# EAGLE design digital_interface(1_1) (EAGLE 9.2.1)
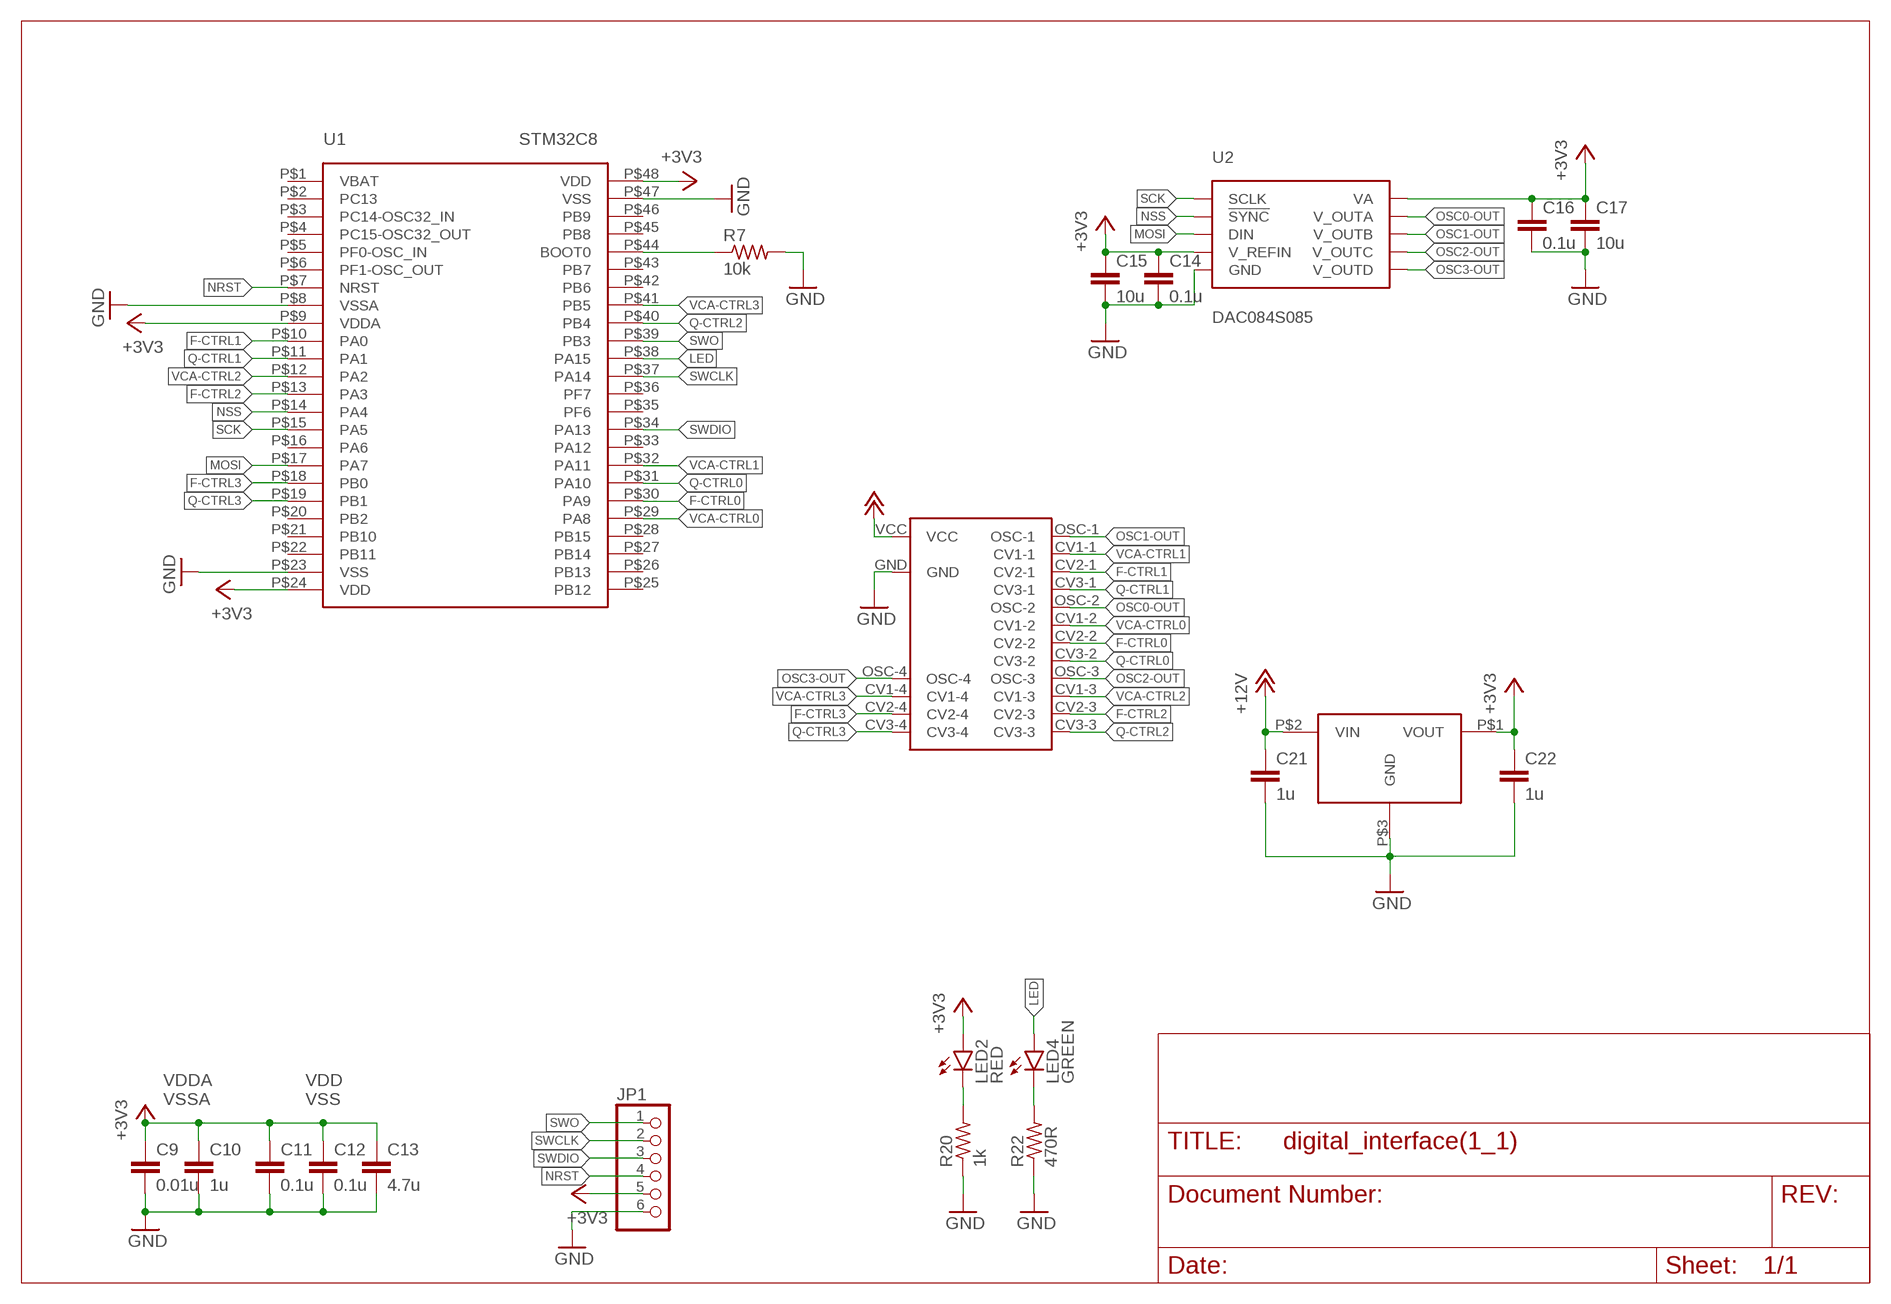
[diagram p0: schematic, sheet 1]

## Parts
C9  0.01u  C-EUC0603  [C0603]
C10  1u  C-EUC0603  [C0603]
C11  0.1u  C-EUC0603  [C0603]
C12  0.1u  C-EUC0603  [C0603]
C13  4.7u  C-EUC0603  [C0603]
C14  0.1u  C-EUC0603  [C0603]
C15  10u  C-EUC0603  [C0603]
C16  0.1u  C-EUC0603  [C0603]
C17  10u  C-EUC0603  [C0603]
C21  1u  C-EUC0603  [C0603]
C22  1u  C-EUC0603  [C0603]
JP1  PINHD-1X6  [1X06]
LED2  RED  LEDSMT1206  [1206]
LED4  GREEN  LEDSMT1206  [1206]
R7  10k  R-US_R0603  [R0603]
R20  1k  R-US_R0603  [R0603]
R22  470R  R-US_R0603  [R0603]
U1  STM32C8  [LQFP48]
U2  DAC084S085  [VSSOP10]
U3  TLV760  [SOT23-3]
U$1  CV_MODULE  [CV_MODULE]

## Nets
+3V3: C9.1 C10.1 C11.1 C12.1 C13.1 C14.1 C15.1 C16.1 C17.1 C22.1 JP1.5 LED2.A U1.P$9(VDDA) U1.P$24(VDD) U1.P$48(VDD) U2.P$1(VA) U2.P$7(V_REFIN) U3.P$1(VOUT)
+12V: C21.1 U3.P$2(VIN) U$1.VCC
F-CTRL0: U1.P$30(PA9) U$1.CV2-2
F-CTRL1: U1.P$10(PA0) U$1.CV2-1
F-CTRL2: U1.P$13(PA3) U$1.CV2-3
F-CTRL3: U1.P$18(PB0) U$1.CV2-4
GND: C9.2 C10.2 C11.2 C12.2 C13.2 C14.2 C15.2 C16.2 C17.2 C21.2 C22.2 JP1.6 R7.2 R20.1 R22.1 U1.P$8(VSSA) U1.P$23(VSS) U1.P$47(VSS) U2.P$6(GND) U3.P$3(GND) U$1.GND
LED: LED4.A U1.P$38(PA15)
MOSI: U1.P$17(PA7) U2.P$8(DIN)
N$8: R7.1 U1.P$44(BOOT0)
N$18: LED2.C R20.2
N$22: LED4.C R22.2
NRST: JP1.4 U1.P$7(NRST)
NSS: U1.P$14(PA4) U2.P$9(!SYNC)
OSC0-OUT: U2.P$2(V_OUTA) U$1.OSC-2
OSC1-OUT: U2.P$3(V_OUTB) U$1.OSC-1
OSC2-OUT: U2.P$4(V_OUTC) U$1.OSC-3
OSC3-OUT: U2.P$5(V_OUTD) U$1.OSC-4
Q-CTRL0: U1.P$31(PA10) U$1.CV3-2
Q-CTRL1: U1.P$11(PA1) U$1.CV3-1
Q-CTRL2: U1.P$40(PB4) U$1.CV3-3
Q-CTRL3: U1.P$19(PB1) U$1.CV3-4
SCK: U1.P$15(PA5) U2.P$10(SCLK)
SWCLK: JP1.2 U1.P$37(PA14)
SWDIO: JP1.3 U1.P$34(PA13)
SWO: JP1.1 U1.P$39(PB3)
VCA-CTRL0: U1.P$29(PA8) U$1.CV1-2
VCA-CTRL1: U1.P$32(PA11) U$1.CV1-1
VCA-CTRL2: U1.P$12(PA2) U$1.CV1-3
VCA-CTRL3: U1.P$41(PB5) U$1.CV1-4
Unconnected: U1.P$1(VBAT) U1.P$2(PC13) U1.P$3(PC14-OSC32_IN) U1.P$4(PC15-OSC32_OUT) U1.P$5(PF0-OSC_IN) U1.P$6(PF1-OSC_OUT) U1.P$16(PA6) U1.P$20(PB2) U1.P$21(PB10) U1.P$22(PB11) U1.P$25(PB12) U1.P$26(PB13) U1.P$27(PB14) U1.P$28(PB15) U1.P$33(PA12) U1.P$35(PF6) U1.P$36(PF7) U1.P$42(PB6) U1.P$43(PB7) U1.P$45(PB8) U1.P$46(PB9)

## Notes on the sheet
- VDDA
  VSSA
- VDD
  VSS

## Library data of the parts
C9-C17 C21 C22 = rcl:C-EU: CAPACITOR, European symbol; SPICEPREFIX: C
JP1 = pinhead:PINHD-1X6: PIN HEADER
LED2 LED4 = led:LED: LED OSRAM: - CHIPLED LG R971, LG N971, LY N971, LG Q971, LY Q971, LO R971, LY R971 LH N974, LH R974 LS Q976, LO Q976, LY Q976 LO Q996 - Hyper CHIPLED LW Q18S LB Q993, LB Q99A, LB R99A - SideLED LS A670, LO A670, LY A670, LG A670, LP A670 LB A673, LV A673, LT A673, LW A673 LH A674 LY A675 LS A676, LA A676, LO A676, LY A676, LW A676 LS A679, LY A679, LG A679 - Hyper Micro SIDELED® LS Y876, LA Y876, LO Y876, LY Y876 LT Y87S - SmartLED LW L88C, LW L88S LB L89C, LB L89S, LG L890 LS L89K, LO L89K, LY L89K LS L896, LA L896, LO L896, LY L896 - TOPLED LS T670, LO T670, LY T670, LG T670, LP T670 LSG T670, LSP T670, LSY T670, LOP T670, LYG T670 LG T671, LOG T671, LSG T671 LB T673, LV T673, LT T673, LW T673 LH T674 LS T676, LA T676, LO T676, LY T676, LB T676, LH T676, LSB T676, LW T676 LB T67C, LV T67C, LT T67C, LS T67K, LO T67K, LY T67K, LW E67C LS E67B, LA E67B, LO E67B, LY E67B, LB E67C, LV E67C, LT E67C LW T67C LS T679, LY T679, LG T679 LS T770, LO T770, LY T770, LG T770, LP T770 LB T773, LV T773, LT T773, LW T773 LH T774 LS E675, LA E675, LY E675, LS T675 LS T776, LA T776, LO T776, LY T776, LB T776 LHGB T686 LT T68C, LB T68C - Hyper Mini TOPLED® LB M676 - Mini TOPLED Santana® LG M470 LS M47K, LO M47K, LY M47K Source: http://www.osram.convergy.de LUXEON: - LUMILED® LXK2-PW12-R00, LXK2-PW12-S00, LXK2-PW14-U00, LXK2-PW14-V00 LXK2-PM12-R00, LXK2-PM12-S00, LXK2-PM14-U00 LXK2-PE12-Q00, LXK2-PE12-R00, LXK2-PE12-S00, LXK2-PE14-T00, LXK2-PE14-U00 LXK2-PB12-K00, LXK2-PB12-L00, LXK2-PB12-M00, LXK2-PB14-N00, LXK2-PB14-P00, LXK2-PB14-Q00 LXK2-PR12-L00, LXK2-PR12-M00, LXK2-PR14-Q00, LXK2-PR14-R00 LXK2-PD12-Q00, LXK2-PD12-R00, LXK2-PD12-S00 LXK2-PH12-R00, LXK2-PH12-S00 LXK2-PL12-P00, LXK2-PL12-Q00, LXK2-PL12-R00 Source: www.luxeon.com KINGBRIGHT: KA-3528ASYC Source: www.kingbright.com
R7 R20 R22 = rcl:R-US_: RESISTOR, American symbol; SPICEPREFIX: R
U1 = synth:STM32C8
U2 = synth:DAC084S085
U3 = synth:TLV760
U$1 = synth:CV_MODULE

## Board
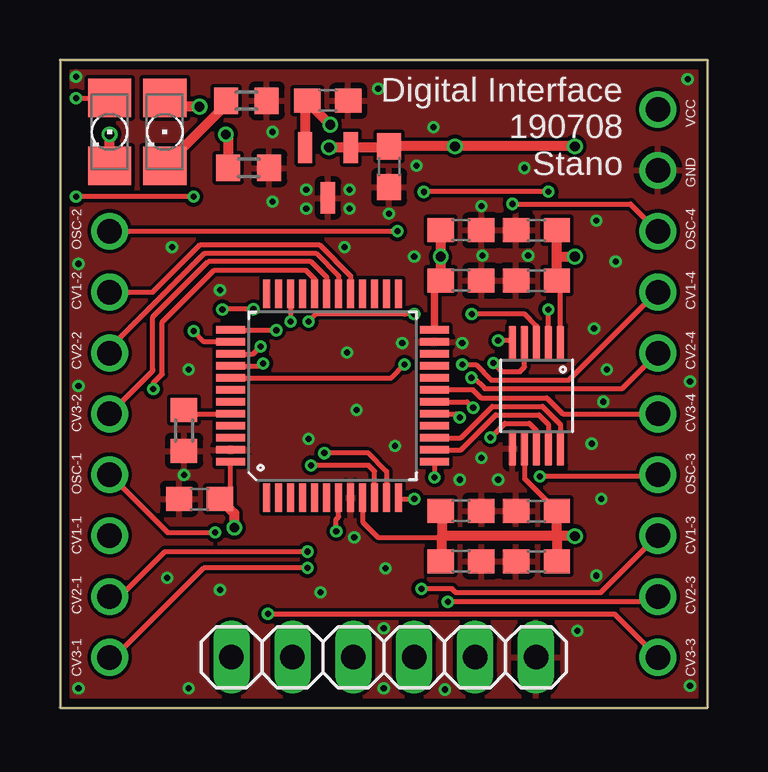
[diagram p1: board, top side]
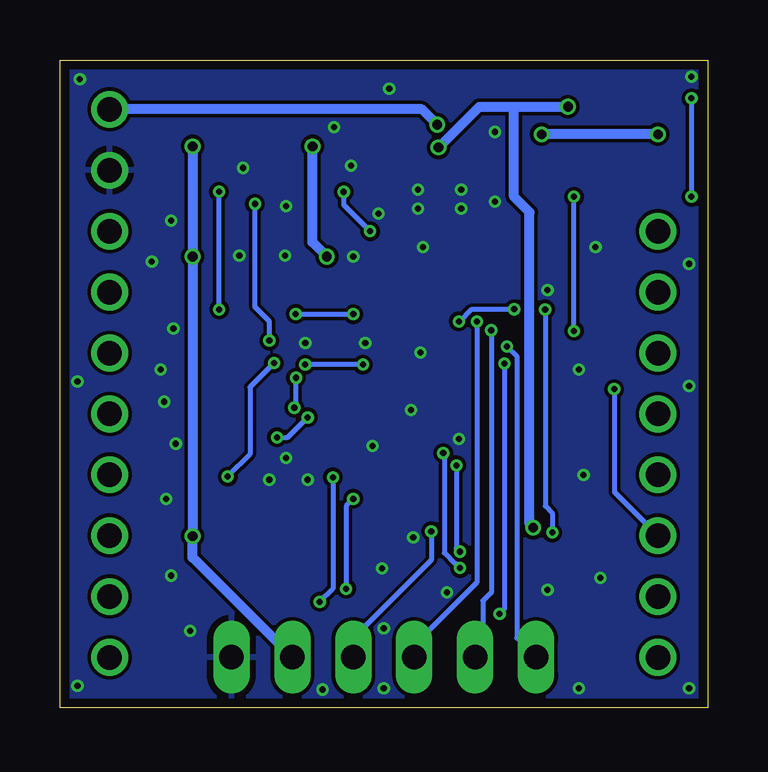
[diagram p2: board, bottom side, seen from below]

Size 27 x 27 mm. Coordinates in mm from the lower left corner, seen from the top.
Outline: 27,27 0,27 0,0 27,0 27,27
Copper layers (1*16): Top 0.035559375mm / dielectric 1.6mm / Bottom 0.035559375mm
Design rules "oshpark-2layer *": minimum track width 6mil, minimum drill 10mil, track to track 6mil, track to pad 6mil, pad to pad 6mil, via to via 6mil, smd to smd 6mil, copper to edge 15mil, drill to drill 6mil, minimum pad ring 5mil, minimum via ring 5mil, stop-mask expansion 2.5mil, vias tented up to drill 0.4mm, thermal gap 10mil

### Footprints (pad centres in the part's own frame; a part is rotated, then mirrored left to right if it is on the bottom)
C0603 = smd 1.1 x 1: 1 -0.85,0; 2 0.85,0
1X06 = drill 1.016 long: 1 -6.35,0; 2 -3.81,0; 3 -1.27,0; 4 1.27,0; 5 3.81,0; 6 6.35,0
1206 = smd 1.6 x 1.803: A -1.422,0; C 1.422,0
R0603 = smd 1 x 1.1: 1 -0.85,0; 2 0.85,0
LQFP48 = smd 0.3 x 1.2: P$1 -2.75,-4.25; P$2 -2.25,-4.25; P$3 -1.75,-4.25; P$4 -1.25,-4.25; P$5 -0.75,-4.25; P$6 -0.25,-4.25; P$7 0.25,-4.25; P$8 0.75,-4.25; P$9 1.25,-4.25; P$10 1.75,-4.25; P$11 2.25,-4.25; P$12 2.75,-4.25; P$25 2.75,4.25; P$26 2.25,4.25; P$27 1.75,4.25; P$28 1.25,4.25; P$29 0.75,4.25; P$30 0.25,4.25; P$31 -0.25,4.25; P$32 -0.75,4.25; P$33 -1.25,4.25; P$34 -1.75,4.25; P$35 -2.25,4.25; P$36 -2.75,4.25 | smd 1.2 x 0.3: P$13 4.25,-2.75; P$14 4.25,-2.25; P$15 4.25,-1.75; P$16 4.25,-1.25; P$17 4.25,-0.75; P$18 4.25,-0.25; P$19 4.25,0.25; P$20 4.25,0.75; P$21 4.25,1.25; P$22 4.25,1.75; P$23 4.25,2.25; P$24 4.25,2.75; P$37 -4.25,2.75; P$38 -4.25,2.25; P$39 -4.25,1.75; P$40 -4.25,1.25; P$41 -4.25,0.75; P$42 -4.25,0.25; P$43 -4.25,-0.25; P$44 -4.25,-0.75; P$45 -4.25,-1.25; P$46 -4.25,-1.75; P$47 -4.25,-2.25; P$48 -4.25,-2.75
VSSOP10 = smd 1.45 x 0.3: P$1 -2.2,1; P$2 -2.2,0.5; P$3 -2.2,0; P$4 -2.2,-0.5; P$5 -2.2,-1; P$6 2.2,-1; P$7 2.2,-0.5; P$8 2.2,0; P$9 2.2,0.5; P$10 2.2,1
SOT23-3 = smd 0.6 x 1.3: P$1 -0.95,-1.05; P$2 0.95,-1.05; P$3 0,1.05
CV_MODULE = drill 1.02: CV1-1 2.07,7.17; CV1-2 2.07,17.32; CV1-3 24.93,7.17; CV1-4 24.93,17.32; CV2-1 2.07,4.63; CV2-2 2.07,14.78; CV2-3 24.93,4.63; CV2-4 24.93,14.78; CV3-1 2.07,2.09; CV3-2 2.07,12.24; CV3-3 24.93,2.09; CV3-4 24.93,12.24; GND 24.93,22.4; OSC-1 2.07,9.71; OSC-2 2.07,19.86; OSC-3 24.93,9.71; OSC-4 24.93,19.86; VCC 24.93,24.94

### Placement (x,y rotation side)
C9  16.72,8.2 0 top
C10  16.72,6.1 0 top
C11  16.72,17.8 0 top
C12  5.82,8.7 180 top
C13  16.72,19.9 0 top
C14  19.87,8.2 180 top
C15  19.87,6.1 180 top
C16  19.87,17.8 180 top
C17  19.87,19.9 180 top
C21  11.17,25.3 0 top
C22  13.72,22.55 270 top
JP1  13.5,2.1 0 top
LED2  4.37,24 270 top
LED4  2.07,24 270 top
R7  5.17,11.55 270 top
R20  7.77,25.3 180 top
R22  7.87,22.5 180 top
U1  11.37,13 0 top
U2  19.87,13 270 top
U3  11.17,22.3 180 top
U$1  0,0 0 top

### Tracks (layer width: path | path; a pad name or v marks a point on that pad's centre or on a via)
+3V3  (via drill 0.4)
  Top 0.203: C11.1 15.62,17.55 | 4.74,25.05 LED2.A | U2.P$1 20.87,17.65 C16.1 | C12.1 7.12,9.15 U1.P$48 | C14.1 19.37,9.55 U2.P$7 | U1.P$9 12.62,7.75 13.27,7.1 15.87,7.1 15.92,7.15
  Top 0.305: 15.62,17.55 U1.P$24
  Top 0.406: v11.22,23.35 U3.P$1 13.67,23.35 C22.1 v16.47,23.4 v21.47,23.4 | v5.82,25.05 4.74,25.05 | C16.1 20.72,18.8 | 20.72,18.8 C17.1 | C13.1 v15.87,18.8 C11.1 | v21.47,7.15 20.72,7.15 | 20.72,7.15 C14.1 | 20.72,7.15 C15.1 | 20.72,18.8 v21.47,18.8 | 20.72,7.15 15.92,7.15 | C12.1 7.27,8.1 v7.27,7.5 | C9.1 15.92,8.15 15.92,7.15 | C10.1 15.92,6.15 15.92,7.15
  Bottom 0.406: v11.22,23.35 9.52,25.05 8.07,25.05 | 8.07,25.05 v5.82,25.05 | v21.47,23.4 v21.47,18.8 v21.47,7.15 21.47,6.26 JP1.5 | v7.27,7.5 7.42,7.65 7.42,20.65 8.07,21.3 8.07,25.05 | v15.87,18.8 16.47,19.4 v16.47,23.4
+12V  (via drill 0.4)
  Top 0.406: U3.P$2 10.22,25.2 C21.1 10.32,25.25 v11.27,24.3
  Bottom 0.406: v11.27,24.3 11.91,24.94 U$1.VCC
F-CTRL0
  Top 0.203: U1.P$30 11.62,17.99 10.67,18.94 6.03,18.94 2.07,14.98 U$1.CV2-2
F-CTRL1  (via drill 0.25)
  Top 0.203: U1.P$10 13.12,9.85 12.87,10.1 v10.47,10.1 | v10.32,6.5 4.37,6.5 2.5,4.63 U$1.CV2-1
  Bottom 0.203: v10.47,10.1 10.47,6.65 v10.32,6.5
F-CTRL2  (via drill 0.25)
  Top 0.203: U1.P$13 v15.62,9.6 | v16.17,4.41 24.71,4.41 U$1.CV2-3
  Bottom 0.203: v15.62,9.6 15.62,4.96 v16.17,4.41
F-CTRL3  (via drill 0.25)
  Top 0.203: U1.P$18 16.98,12.75 v17.23,12.5 | v17.16,13.75 17.26,13.75 17.71,13.3 20.41,13.3 20.42,13.3 23.45,13.3 U$1.CV2-4
  Bottom 0.203: v17.23,12.5 17.16,12.57 v17.16,13.75
GND  (via drill 0.25)
  other vias: 0.67,26.3 8.87,24 13.27,25.8 15.57,24.2 26.17,26.2 8.87,21.1 10.27,21.6 10.27,20.8 12.07,21.6 12.07,20.8 13.72,20.6 17.57,20.9 17.62,18.85 19.52,18.85 0.77,13.4 5.37,14.1 11.97,14.8 14.27,15.2 16.77,15.2 26.27,13.6 17.57,10.4 16.67,9.5 5.17,9.7 6.67,4.9 4.47,5.4 0.77,0.8 10.87,4.8 13.57,5.8 22.37,5.5 26.27,0.9 10.37,11.2 12.37,12.4 13.97,10.9 18.27,9.5 12.27,7.1 5.37,0.8 21.57,3.2 22.57,8.7 22.17,11 22.27,15.8 23.17,18.6 0.77,18.5 4.67,19.2 6.67,17.4 11.87,19.2 14.77,18.8 22.37,20.3 19.37,22.5 14.87,22.6 22.8,14.1 22.65,12.75 16.05,0.75 13.5,0.8 13.5,3.3
  pour Top: 0,0 0,27 27,27 27,0
  pour Bottom: 0,0 0,27 27,27 27,0
LED  (via drill 0.25)
  Top 0.203: U1.P$38 6.02,15.25 v5.57,15.7 | v0.67,25.4 2.05,25.4 LED4.A | v5.57,21.3 v0.67,21.3
  Bottom 0.203: v0.67,25.4 v0.67,21.3 | v5.57,15.7 v5.57,21.3
MOSI  (via drill 0.25)
  Top 0.203: v17.95,11.27 17.97,11.27 18.55,11.84 19.57,11.84 19.87,11.54 U2.P$8 | U1.P$17 16.52,12.25 v16.67,12.1
  Bottom 0.203: v17.95,11.27 17.5,11.27 v16.67,12.1
N$8
  Top 0.203: R7.1 5.32,12.25 U1.P$44
N$18
  Top 0.406: R20.2 6.92,25.13 LED2.C
N$22  (via drill 0.4)
  Top 0.406: LED4.C v2.07,23.9 | v6.92,23.9 7.02,23.8 R22.2
  Bottom 0.406: v2.07,23.9 v6.92,23.9
NRST  (via drill 0.25)
  Top 0.203: v11.52,7.35 11.52,7.85 11.62,7.95 U1.P$7
  Bottom 0.203: v11.52,7.35 11.52,6.15 14.77,2.9 JP1.4
NSS
  Top 0.203: U1.P$14 16.72,10.75 18.17,12.2 19.97,12.2 20.37,11.8 U2.P$9
OSC0-OUT  (via drill 0.25)
  Top 0.203: U2.P$2 v20.36,16.6 | v15.17,21.5 v15.18,21.51 v20.37,21.51 | U$1.OSC-2 v14.07,19.86
  Bottom 0.203: v20.36,16.6 v20.36,21.5 v20.37,21.51 | v15.17,21.5 15.17,20.96 v14.07,19.86
OSC1-OUT  (via drill 0.25)
  Top 0.203: v17.17,16.41 19.39,16.4 19.87,15.92 U2.P$3 | v14.77,16.4 14.38,16.4 10.67,16.4 v10.37,16.1 | v6.47,7.3 4.48,7.3 U$1.OSC-1 | v8.06,16.61 v6.78,16.61 v6.77,16.6
  Bottom 0.203: v17.17,16.41 v14.77,16.4 | v10.37,16.1 10.33,16.1 9.82,16.61 v8.06,16.61 | v6.47,7.3 6.47,8.1 6.77,8.4 v6.77,16.6
OSC2-OUT  (via drill 0.25)
  Top 0.203: v20,9.63 24.85,9.63 U$1.OSC-3 | v18.08,14.36 18.43,14.01 19.18,14.01 19.37,14.2 U2.P$4
  Bottom 0.203: v18.08,14.36 19.08,13.36 19.08,10.56 v20,9.63
OSC3-OUT  (via drill 0.25)
  Top 0.203: v18.87,21 23.79,21 U$1.OSC-4 | U2.P$5 18.77,15.3 v18.27,15.3
  Bottom 0.203: v18.87,21 18.87,16.7 18.27,16.1 v18.27,15.3
Q-CTRL0
  Top 0.203: U1.P$31 11.12,17.94 10.47,18.59 6.18,18.59 3.87,16.28 3.87,14.1 3.87,14.04 U$1.CV3-2
Q-CTRL1  (via drill 0.25)
  Top 0.203: U1.P$11 13.62,9.85 12.87,10.61 v11.02,10.61 | v10.32,5.82 5.99,5.82 2.26,2.09 U$1.CV3-1
  Bottom 0.203: v11.02,10.61 10.98,10.57 10.98,6.44 10.53,5.99 10.49,5.99 v10.32,5.82
Q-CTRL2  (via drill 0.25)
  Top 0.203: v8.67,3.9 23.12,3.9 U$1.CV3-3 | U1.P$40 8.37,14.25 v8.47,14.35
  Bottom 0.203: v8.47,14.35 8.47,4.1 v8.67,3.9
Q-CTRL3
  Top 0.203: U1.P$19 17.23,13.24 17.56,12.91 20.3,12.91 20.97,12.24 U$1.CV3-4
SCK
  Top 0.203: U1.P$15 16.72,11.25 18.02,12.56 20.12,12.56 20.73,11.95 20.73,11.94 20.87,11.8 U2.P$10
SWCLK  (via drill 0.25)
  Top 0.203: v9.02,15.73 9,15.75 U1.P$37
  Bottom 0.203: JP1.2 9.37,2.42 9.37,4.45 9.02,4.8 v9.02,15.73
SWDIO  (via drill 0.25)
  Top 0.203: U1.P$34 v9.62,16.11 v9.61,16.1
  Bottom 0.203: JP1.3 12.23,2.6 9.61,5.22 v9.61,16.1
SWO  (via drill 0.25)
  Top 0.203: U1.P$39 8.05,14.75 v8.36,15.06
  Bottom 0.203: JP1.1 7.95,2.9 7.95,14.65 v8.36,15.06
VCA-CTRL0
  Top 0.203: U1.P$29 12.12,18 10.82,19.3 5.85,19.3 3.87,17.32 U$1.CV1-2
VCA-CTRL1  (via drill 0.25)
  Top 0.203: v3.89,13.28 3.89,13.52 4.27,13.9 4.27,16.08 6.43,18.23 10.25,18.23 10.62,17.86 U1.P$32
  Bottom 0.203: v3.89,13.28 3.87,13.26 3.87,8.97 U$1.CV1-1
VCA-CTRL2  (via drill 0.25)
  Top 0.203: U1.P$12 14.17,8.7 v14.77,8.7 | v15.07,4.95 16.35,4.95 16.5,4.8 22.56,4.8 U$1.CV1-3
  Bottom 0.203: v14.77,8.7 15.07,8.4 v15.07,4.95
VCA-CTRL3  (via drill 0.25)
  Top 0.203: U1.P$41 13.82,13.75 v14.37,14.3 | v16.77,14.3 17.33,14.3 17.98,13.65 21.21,13.65 24.88,17.32 U$1.CV1-4
  Bottom 0.203: v14.37,14.3 v16.77,14.3

### Text on the board
tPlace: VCC | Digital Interface / 190708 / Stano | GND | OSC-2 | OSC-4 | CV1-2 | CV1-4 | CV2-2 | CV2-4 | CV3-2 | CV3-4 | OSC-1 | OSC-3 | CV1-1 | CV1-3 | CV2-1 | CV2-3 | CV3-1 | CV3-3